# EAGLE design pt3MX (EAGLE 6.4)
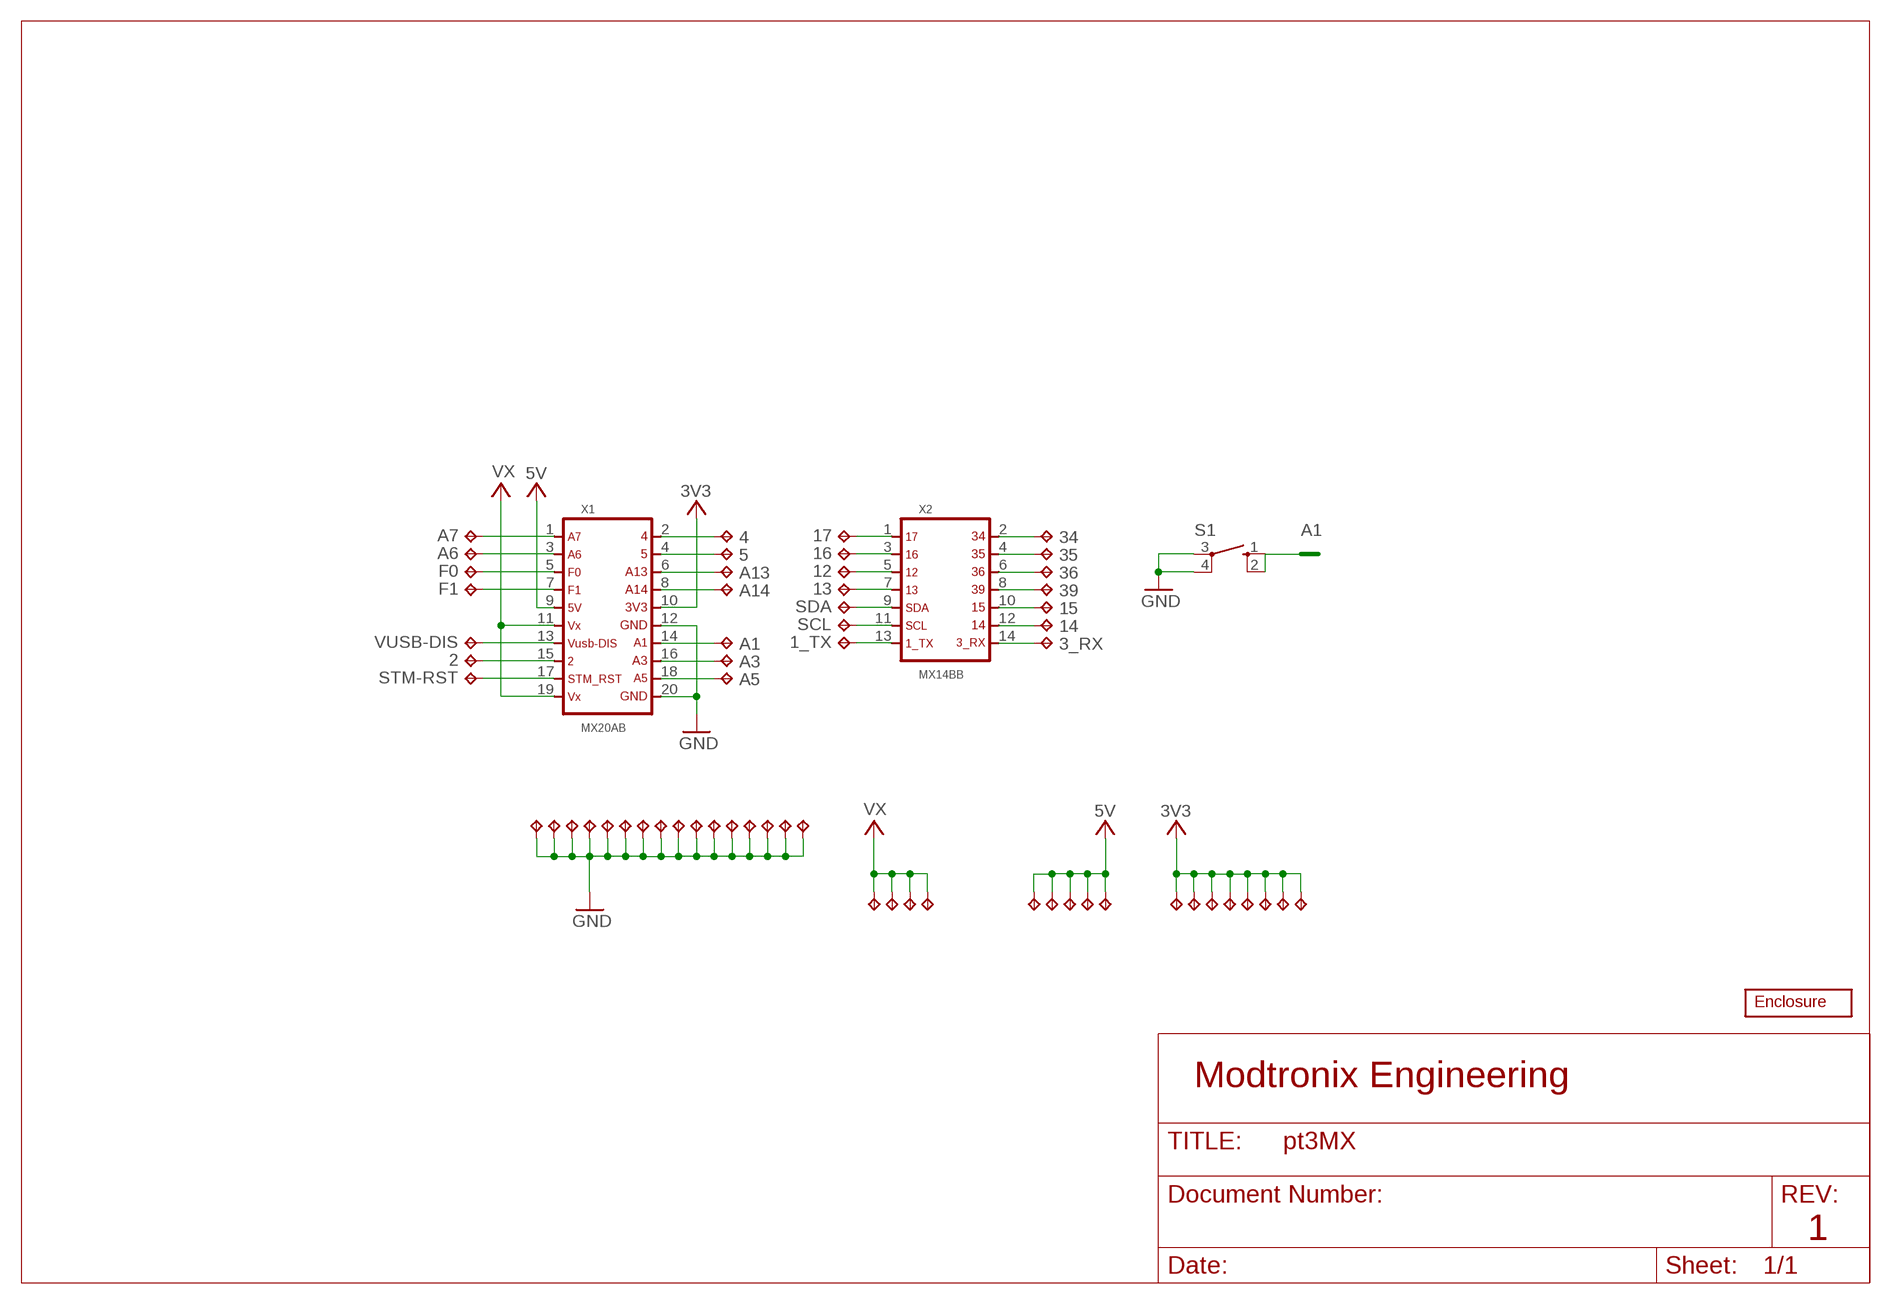
[diagram p0: schematic, sheet 1]

## Parts
1_TX  TPD10B  [TP-10B]
2  TPD10B  [TP-10B]
3_RX  TPD10B  [TP-10B]
4  TPD10C  [TP-10C]
5  TPD10B  [TP-10B]
12  TPD10B  [TP-10B]
13  TPD10B  [TP-10B]
14  TPD10B  [TP-10B]
15  TPD10C  [TP-10C]
16  TPD10B  [TP-10B]
17  TPD10B  [TP-10B]
34  TPD10C  [TP-10C]
35  TPD10C  [TP-10C]
36  TPD10B  [TP-10B]
39  TPD10B  [TP-10B]
A1  TPD10-D200  [TP-10-D200]
A3  TPD10-D200  [TP-10-D200]
A5  TPD10B  [TP-10B]
A6  TPD10B  [TP-10B]
A7  TPD10B  [TP-10B]
A13  TPD10B  [TP-10B]
A14  TPD10C  [TP-10C]
F0  TPD10C  [TP-10C]
F1  TPD10-D200  [TP-10-D200]
S1  SWITCH-MICRO  [SW-TACTILE-4P-TH]
SCL  TPD10B  [TP-10B]
SDA  TPD10C  [TP-10C]
STM-RST  TPD10B  [TP-10B]
U$1  ENC_2015SMX-AND-EC-B  [ENC_2015S_3H_MX-AND-EC_DIM-MSR_B]
U$2  TPD10-D205  [TP-10-D205]
U$5  TPD10D  [TP-10D]
U$6  TPD10-D205  [TP-10-D205]
U$7  TPD10-D205  [TP-10-D205]
U$8  TPD10-D205  [TP-10-D205]
U$10  TPD10D  [TP-10D]
U$11  TPD10C  [TP-10C]
U$12  TPD10-D205  [TP-10-D205]
U$13  TPD10C  [TP-10C]
U$14  TPD10  [TP-10]
U$17  TPD10-D205  [TP-10-D205]
U$22  TPD10-D205  [TP-10-D205]
U$23  TPD10C  [TP-10C]
U$24  TPD10C  [TP-10C]
U$25  TPD10C  [TP-10C]
U$26  TPD10C  [TP-10C]
U$27  TPD10C  [TP-10C]
U$28  TPD10C  [TP-10C]
U$29  TPD10C  [TP-10C]
U$30  TPD10C  [TP-10C]
U$31  TPD10C  [TP-10C]
U$32  TPD10C  [TP-10C]
U$33  TPD10B  [TP-10B]
U$34  TPD10C  [TP-10C]
U$35  TPD10C  [TP-10C]
U$36  TPD10C  [TP-10C]
U$53  TPD10-D205  [TP-10-D205]
U$58  TPD10C  [TP-10C]
U$60  TPD10-D205  [TP-10-D205]
U$85  TPD10-D205  [TP-10-D205]
U$86  TPD10-D205  [TP-10-D205]
U$87  TPD10-D205  [TP-10-D205]
U$90  TPD10-D205  [TP-10-D205]
VUSB-DIS  TPD10B  [TP-10B]
X1  MX20AB  [MA10-2-NONUM]
X2  MX14BB  [MA07-2-NONUM]

## Nets
1_TX: 1_TX.1(TP) X2.13
2: 2.1(TP) X1.15
3_RX: 3_RX.1(TP) X2.14
3V3: U$14.1(TP) U$25.1(TP) U$26.1(TP) U$31.1(TP) U$32.1(TP) U$53.1(TP) U$85.1(TP) U$86.1(TP) X1.10
4: 4.1(TP) X1.2
5: 5.1(TP) X1.4
5V [power]: U$12.1(TP) U$13.1(TP) U$23.1(TP) U$24.1(TP) U$87.1(TP) X1.9
12: 12.1(TP) X2.5
13: 13.1(TP) X2.7
14: 14.1(TP) X2.12
15: 15.1(TP) X2.10
16: 16.1(TP) X2.3
17: 17.1(TP) X2.1
34: 34.1(TP) X2.2
35: 35.1(TP) X2.4
36: 36.1(TP) X2.6
39: 39.1(TP) X2.8
A1: A1.1(TP) S1.1(S) S1.2(S1) X1.14
A3: A3.1(TP) X1.16
A5: A5.1(TP) X1.18
A6: A6.1(TP) X1.3
A7: A7.1(TP) X1.1
A13: A13.1(TP) X1.6
A14: A14.1(TP) X1.8
F0: F0.1(TP) X1.5
F1: F1.1(TP) X1.7
GND [power]: S1.3(P) S1.4(P1) U$5.1(TP) U$6.1(TP) U$7.1(TP) U$8.1(TP) U$10.1(TP) U$11.1(TP) U$17.1(TP) U$22.1(TP) U$27.1(TP) U$28.1(TP) U$29.1(TP) U$30.1(TP) U$34.1(TP) U$35.1(TP) U$36.1(TP) U$60.1(TP) X1.12 X1.20
SCL: SCL.1(TP) X2.11
SDA: SDA.1(TP) X2.9
STM-RST: STM-RST.1(TP) X1.17
VUSB-DIS: VUSB-DIS.1(TP) X1.13
VX [power]: U$2.1(TP) U$33.1(TP) U$58.1(TP) U$90.1(TP) X1.11 X1.19

## Notes on the sheet
- Modtronix Engineering
- 1

## Library data of the parts
1_TX 2 3_RX 4 5 12-17 34-36 39 A1 A3 A5-A7 A13 A14 F0 F1 SCL SDA STM-RST U$2 U$5-U$8 U$10-U$14 U$17 U$22-U$36 U$53 U$58 U$60 U$85-U$87 U$90 VUSB-DIS = mx-conn:TP
S1 = mx-misc:SWITCH-MICRO: OMRON SWITCH
U$1 = mx-misc:ENC_2015S
X1 = mx-conn:MX20A
X2 = mx-conn:MX14B

## Net classes
0 default: width 0.2 mm, drill 0.5 mm, clearance 0.2 mm
1 power: width 0.3 mm, drill 0.5 mm, clearance 0.2 mm

## Board
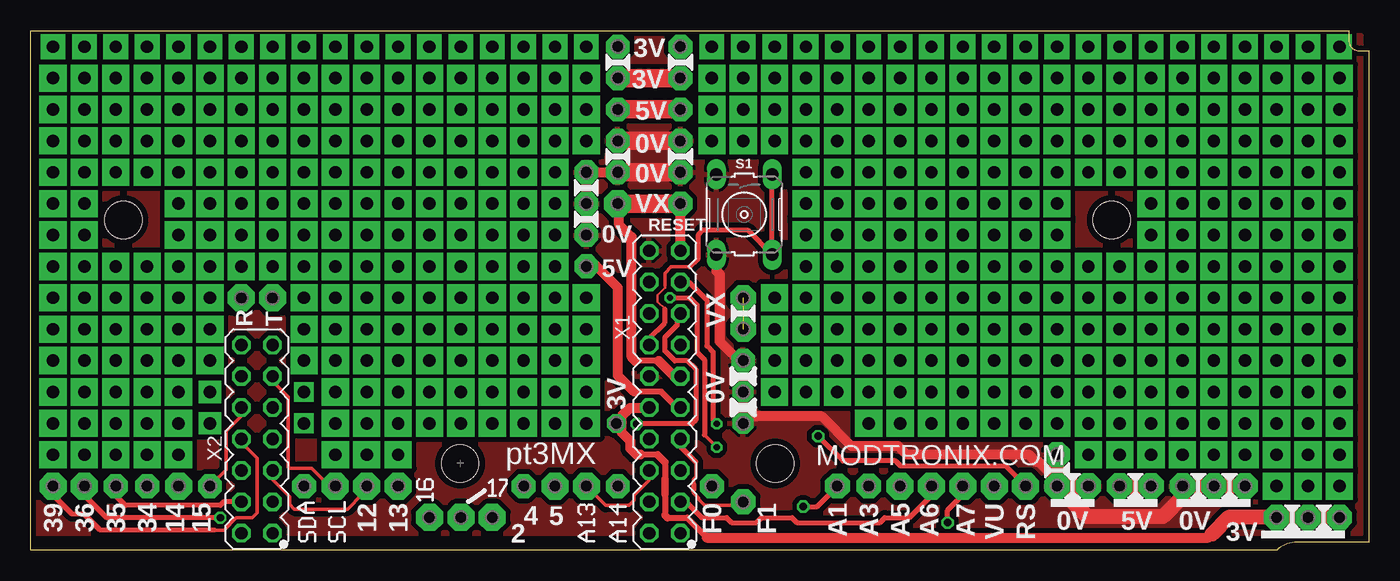
[diagram p1: board, top side]
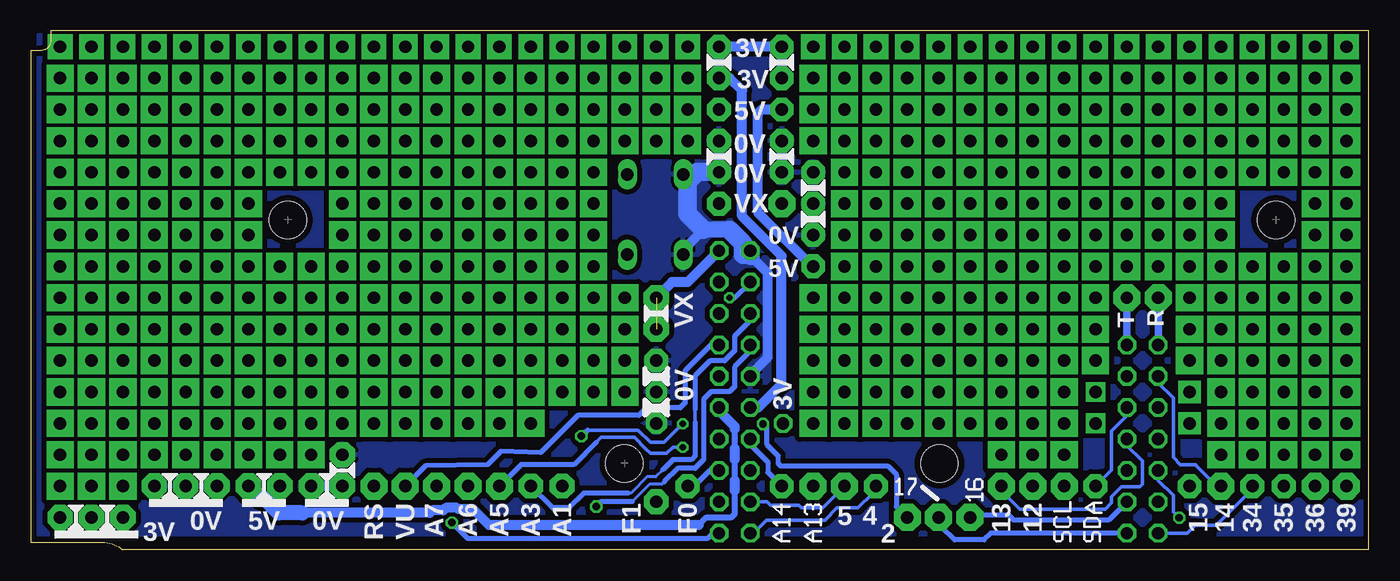
[diagram p2: board, bottom side, seen from below]

Size 108.3 x 42 mm. Coordinates in mm from the lower left corner, seen from the top.
Copper layers (1*16): Top 0.035mm / dielectric 1.5mm / Bottom 0.035mm
Design rules "12w_10clr_24drl *": minimum track width 0.2mm, minimum drill 0.5mm, track to track 10mil, track to pad 10mil, pad to pad 10mil, via to via 12mil, smd to smd 6mil, copper to edge 0.1mm, drill to drill 0.1mm, minimum pad ring 0.2mm, minimum via ring 0.2mm, stop-mask expansion 4mil, vias tented up to drill 28mil, thermal gap 10mil
Holes 3 mm at 34.75,7
tRestrict: area 33.2,5.5 to 36.2,8.5
bRestrict: area 33.2,5.5 to 36.3,8.5

### Footprints (pad centres in the part's own frame; a part is rotated, then mirrored left to right if it is on the bottom)
TP-10B = drill 1 pad 2.184 octagon: 1 0,0
TP-10C = drill 1 pad 1.93 octagon: 1 0,0
TP-10-D200 = drill 1 pad 2 octagon: 1 0,0
SW-TACTILE-4P-TH = drill 1.016 long: 1 -3.251,2.261; 2 3.251,2.261; 3 -3.251,-2.261; 4 3.251,-2.261
ENC_2015S_3H_MX-AND-EC_DIM-MSR_B = hole 3: 52.75,-19.7; 0,0; 80,0
TP-10-D205 = drill 1 pad 2.05 octagon: 1 0,0
TP-10D = drill 1 pad 1.7 octagon: 1 0,0
TP-10 = drill 1 pad 1.4 octagon: 1 0,0
MA10-2-NONUM = drill 1 octagon: 1 -11.43,-1.27; 2 -11.43,1.27; 3 -8.89,-1.27; 4 -8.89,1.27; 5 -6.35,-1.27; 6 -6.35,1.27; 7 -3.81,-1.27; 8 -3.81,1.27; 9 -1.27,-1.27; 10 -1.27,1.27; 11 1.27,-1.27; 12 1.27,1.27; 13 3.81,-1.27; 14 3.81,1.27; 15 6.35,-1.27; 16 6.35,1.27; 17 8.89,-1.27; 18 8.89,1.27; 19 11.43,-1.27; 20 11.43,1.27
MA07-2-NONUM = drill 1 octagon: 1 -7.62,-1.27; 2 -7.62,1.27; 3 -5.08,-1.27; 4 -5.08,1.27; 5 -2.54,-1.27; 6 -2.54,1.27; 7 0,-1.27; 8 0,1.27; 9 2.54,-1.27; 10 2.54,1.27; 11 5.08,-1.27; 12 5.08,1.27; 13 7.62,-1.27; 14 7.62,1.27

### Placement (x,y rotation side)
1_TX  19.57,20.4 270 top
2  37.35,2.62 270 top
3_RX  17.03,20.4 270 top
4  39.89,5.16 270 top
5  42.43,5.16 270 top
12  27.19,5.16 270 top
13  29.73,5.16 270 top
14  11.95,5.16 270 top
15  14.49,5.16 270 top
16  32.27,2.62 270 top
17  34.81,2.62 270 top
34  9.41,5.16 0 top
35  6.87,5.16 270 top
36  4.33,5.16 270 top
39  1.79,5.16 0 top
A1  65.29,5.16 270 top
A3  67.83,5.16 270 top
A5  70.37,5.16 270 top
A6  72.91,5.16 270 top
A7  75.45,5.16 270 top
A13  44.97,5.16 270 top
A14  47.51,5.16 270 top
F0  55.13,5.16 270 top
F1  57.67,3.89 270 top
S1  57.75,27.14 270 top
SCL  24.65,5.16 270 top
SDA  22.11,5.16 270 top
STM-RST  80.53,5.16 270 top
U$1  7.5,26.7 0 top
U$2  57.67,20.4 90 top
U$3  [ESP32MX_20-14P_0H_REF]  34.75,7 0 bottom
U$5  57.67,10.24 0 top
U$6  93.23,5.16 0 top
U$7  98.31,5.16 0 top
U$8  95.77,5.16 0 top
U$9  [A-56]  45.61,0.71 90 top
U$10  57.67,12.78 0 top
U$11  57.67,15.32 0 top
U$12  88.15,5.16 90 top
U$13  44.97,22.94 0 top
U$14  47.41,10.24 0 top
U$17  83.07,5.16 0 top
U$22  83.07,7.7 0 top
U$23  47.51,35.64 0 top
U$24  52.59,35.64 0 top
U$25  52.59,38.18 0 top
U$26  47.51,40.72 0 top
U$27  52.59,30.56 0 top
U$28  47.51,30.56 0 top
U$29  52.59,33.1 0 top
U$30  47.51,33.1 0 top
U$31  52.59,40.72 0 top
U$32  47.51,38.18 0 top
U$33  47.51,28.02 0 top
U$34  44.97,30.56 0 top
U$35  44.97,28.02 0 top
U$36  44.97,25.48 0 top
U$37  [3-56]  45.61,2.87 90 top
U$38  [S-56]  23,0.71 90 top
U$39  [4-56]  48.14,2.87 90 top
U$40  [A-56]  48.14,0.71 90 top
U$41  [1-56N]  45.61,1.98 90 top
U$42  [1-56N]  48.14,1.98 90 top
U$43  [S-56]  25.41,0.71 90 top
U$44  [D-56]  23,1.86 90 top
U$45  [A-56]  22.87,3 90 top
U$46  [C-56]  25.41,1.86 90 top
U$47  [L-56]  25.41,3.13 90 top
U$48  [1-56N]  32.52,4.02 90 top
U$49  [6-56]  32.52,4.91 90 top
U$50  [1-56N]  37.1,4.4 0 top
U$51  [S-56]  21.75,0.71 90 bottom
U$52  [7-56N]  37.98,4.4 0 top
U$53  100.85,2.62 0 top
U$54  [S-56]  24.16,0.71 90 bottom
U$55  [D-56]  21.75,1.86 90 bottom
U$56  [A-56]  21.62,3 90 bottom
U$57  [C-56]  24.16,1.86 90 bottom
U$58  52.59,28.02 0 top
U$59  [L-56]  24.16,3.13 90 bottom
U$60  85.61,5.16 0 top
U$61  [1-56N]  31.27,4.02 90 bottom
U$62  [6-56]  31.27,4.91 90 bottom
U$63  [1-56N]  38.25,4.5 0 bottom
U$64  [7-56N]  37.23,4.5 0 bottom
U$65  [A-56]  44.36,0.71 90 bottom
U$66  [4-56]  46.89,2.87 90 bottom
U$67  [A-56]  46.89,0.71 90 bottom
U$68  [1-56N]  44.36,1.98 90 bottom
U$69  [1-56N]  46.89,1.98 90 bottom
U$70  [3-56]  44.36,2.87 90 bottom
U$85  105.93,2.62 90 top
U$86  103.39,2.62 90 top
U$87  90.69,5.16 0 top
U$90  57.67,17.86 0 top
VUSB-DIS  77.99,5.16 270 top
X1  51.32,12.78 90 top
X2  18.3,8.97 90 top

### Tracks (layer width: path | path; a pad name or v marks a point on that pad's centre or on a via)
1_TX
  Bottom 0.6: 1_TX.1 X2.13
2  (via drill 0.6)
  Top 0.4: v49.03,10.2 53.53,10.2 53.83,10.5 53.83,14.6 53.13,15.3 52.13,15.3 51.33,16.1 51.33,17.2 52.33,18.2 52.33,18.87 X1.15
  Bottom 0.4: v49.03,10.2 48.73,9.9 48.73,8.55 47.8,7.63 47.8,7 47.6,6.8 38.93,6.8 38.23,6.1 38.23,3.5 2.1
3_RX
  Bottom 0.6: 3_RX.1 X2.14
3V3
  Top 0.3: U$14.1 47.77,10.24 47.83,10.3
  Top 0.48: 51.53,2.6 53.13,2.6
  Top 0.5: 51.33,7.1 51.33,5.7 | 51.33,4.5 51.33,2.8 | 53.13,2.6 54.73,1 | 50.73,7.7 49.33,7.7
  Top 0.6: 50.73,7.7 51.33,7.1 | 51.33,5.7 51.33,4.5 | 51.33,2.8 51.53,2.6
  Top 0.8: 54.73,1 95.33,1 95.63,1.3 | 49.33,7.7 49.03,7.7 48.53,8.2 48.53,8.8 47.83,9.5 47.83,10.3 47.83,10.8 48.53,11.5 X1.10
  Top 1.2: U$85.1 U$86.1 U$53.1 96.95,2.62 95.63,1.3
  Top 1.5: U$25.1 U$32.1
  Bottom 0.8: X1.10 49.42,11.51 47.53,13.4 47.53,23.8 50.73,27 50.73,37.18 51.73,38.18 U$25.1 | U$32.1 47.49,38.2 47.49,40.7 U$26.1 U$31.1 52.59,38.26 52.53,38.2
4
  Bottom 0.3: X1.2 49.78,1.35 48.73,2.4 44.03,2.4 43.03,3.4 41.33,3.4 40.13,4.6 40.13,4.92 4.1
5
  Bottom 0.3: X1.4 48.72,3.89 48.43,3.6 46.13,3.6 45.93,3.4 44.19,3.4 5.1
5V
  Top 0.48: 51.03,12.8 48.83,12.8
  Top 0.5: X1.9 52.32,11.51 51.03,12.8
  Top 0.8: 48.83,12.8 47.53,14.1 47.53,21.2 45.63,23.1 45.38,22.53 U$13.1 | 47.03,35.6 47.47,35.6 U$23.1
  Top 1.2: U$12.1 U$87.1
  Top 1.5: U$23.1 U$24.1
  Bottom 0.48: 51.63,2.6 53.63,2.6
  Bottom 0.5: 51.33,9.8 51.33,8.2 | 51.33,7.3 51.33,5.6 | 51.33,4.8 51.33,2.9 51.63,2.6 | 53.63,2.6 54.23,2
  Bottom 0.8: X1.9 52.59,11.26 51.33,10 51.33,9.8 | 51.33,8.2 51.33,7.3 | 51.33,5.6 51.33,4.8 | 54.23,2 71.21,2 72.51,3.3 73.71,3.3 73.81,3.4 74.71,3.4 74.91,3.2 75.81,3.2 76.01,3 86.33,3 | U$13.1 45.07,22.94 49.43,27.3 49.43,35.34 49.13,35.64 U$23.1
  Bottom 1.2: 86.33,3 88.23,3 89.43,4.2 89.73,4.2 U$87.1
12
  Top 0.3: X2.5 19.57,5.66 20.93,4.3 20.93,3.7 21.33,3.3 25.63,3.3 26.83,4.5 26.83,4.8 12.1
13
  Bottom 0.3: X2.7 19.57,8.44 18.33,7.2 18.33,5.3 18.53,5.1 20.03,5.1 20.83,4.3 20.83,3.8 21.33,3.3 28.23,3.3 29.73,4.8 13.1
14
  Bottom 0.3: X2.12 17.03,13.5 15.83,12.3 15.83,7.5 15.23,6.9 13.99,6.9 13.99,6.86 12.53,5.4 14.1
15
  Top 0.3: X2.10 17.03,10.8 15.83,9.6 15.83,6.5 15.1
16
  Bottom 0.4: X2.3 19.54,3.89 20.63,2.8 21.03,2.4 28.73,2.4 29.13,2.8 32.09,2.8 16.1
17
  Bottom 0.4: X2.1 30.58,1.35 31.13,0.8 33.53,0.8 34.53,1.8 34.53,2.34 17.1
34
  Bottom 0.3: X2.2 14.68,1.35 14.03,2 12.33,2 9.63,4.7 8.95,4.7 34.1
  Bottom 0.4: 9.25,5 34.1
35
  Top 0.4: X2.4 15.62,3.89 15.33,3.6 7.65,3.6 6.95,4.3 6.95,5.08 35.1
36  (via drill 0.6)
  Top 0.3: 4.35,5.14 36.1
  Top 0.4: v15.33,2.6 6.13,2.6 4.53,4.2 4.53,4.96 36.1
  Bottom 0.3: X2.6 17.03,5.6 15.83,4.4 15.83,3.1 v15.33,2.6
39
  Top 0.3: X2.8 17.03,8.7 18.33,7.4 18.33,3 17.93,2.6 16.63,2.6 15.63,1.6 14.85,1.6
  Top 0.4: 14.85,1.6 5.63,1.6 4.33,2.9 3.33,2.9 1.73,4.5 1.73,5.1 39.1
A1  (via drill 0.6)
  Top 0.22: 51.33,19.5 50.73,20.1 50.73,20.6 51.33,21.2 51.33,21.4
  Top 0.3: 51.33,21.4 51.33,22.4 51.83,22.9 53.33,22.9
  Top 0.4: X1.14 50.05,17.12 51.33,18.4 51.33,19.5 | 53.33,22.9 54.03,23.6 54.03,25.5 54.43,25.9 58,25.9 S1.2 S1.1 | v62.53,3.5 63.63,3.5 A1.1
  Bottom 0.25: 57.03,5.5 57.23,5.3 58.23,5.3 59.63,3.9
  Bottom 0.4: X1.14 50.03,16.57 50.03,16.1 51.33,14.8 51.33,13.2 51.73,12.8 53.23,12.8 53.83,12.2 53.83,7.3 54.53,6.6 55.93,6.6 57.03,5.5 | 59.63,3.9 62.13,3.9 v62.53,3.5
A3
  Bottom 0.25: 57.13,6.5 57.73,5.9 58.43,5.9 59.73,4.6 59.93,4.6
  Bottom 0.3: 54.53,11.4 54.53,10.3
  Bottom 0.4: X1.16 50.05,18.58 51.33,17.3 51.33,16.1 52.13,15.3 53.33,15.3 54.53,14.1 54.53,11.4 | 54.53,10.3 54.53,7.6 54.83,7.3 56.33,7.3 57.13,6.5 | 59.93,4.6 63.53,4.6 64.73,3.4 66.07,3.4 A3.1
A5  (via drill 0.5)
  Top 0.3: 54.53,9.3 v55.53,8.3
  Top 0.4: v51.73,20.4 53.33,20.4 53.93,19.8 53.93,16 54.53,15.4 54.53,9.3
  Bottom 0.3: v55.53,8.3 56.33,8.3 56.83,7.8 58.13,7.8 58.53,8.2 59.43,9.1 62.13,9.1 62.53,8.7
  Bottom 0.4: v51.73,20.4 51.32,20.4 X1.18 | 62.53,8.7 64.33,6.9 68.63,6.9 A5.1
A6
  Top 0.4: X1.3 53.04,3.89 54.33,2.6 56.33,2.6 56.73,2.2 58.73,2.2 59.13,2.6 61.63,2.6 62.03,2.2 68.73,2.2 69.13,2.6 | 69.13,2.6 69.11,2.6 | 69.13,2.6 71.11,2.6 72.81,4.3 72.81,5.06 A6.1
A7  (via drill 0.6)
  Top 0.4: v74.21,2.2 74.21,3.2 75.41,4.4 75.41,5.12 A7.1
  Bottom 0.4: X1.1 53.08,1.35 53.53,0.9 72.91,0.9 v74.21,2.2
A13
  Top 0.3: X1.6 50.05,5.62 48.83,4.4 48.83,4 48.43,3.6 46.53,3.6 A13.1
A14
  Bottom 0.4: X1.8 50.05,8.52 48.63,7.1 48.63,6.28 A14.1
F0
  Bottom 0.4: X1.5 53.36,6.43 53.36,6.42 54.63,5.15 F0.1
F1
  Top 0.3: 53.83,7.1 53.83,5.9 53.63,5.7 53.63,5.4 | 53.63,4.8 53.63,4.6 54.03,4.2 54.03,4.1 54.53,3.6 57.38,3.6 F1.1
  Top 0.4: X1.7 52.59,8.34 53.83,7.1 | 53.63,5.4 53.63,4.8
GND
  Top 0.8: U$17.1 83.07,5.66 81.63,7.1 81.38,7.1 80.78,7.7 70.93,7.7 70.23,8.4 66.43,8.4 64.03,10.8 58.67,10.8 57.67,11.8 | U$5.1 57.67,11.8 | U$36.1 U$35.1 U$34.1 48.03,30.56 | S1.4 55.49,22.58 55.77,22.3 55.77,16.86 57.13,15.5 57.49,15.5 U$11.1 U$10.1 57.67,11.8
  Top 1.2: 84.33,5.16 84.33,3.9 85.53,2.7 91.63,2.7 93.23,4.3 U$6.1 U$8.1 U$7.1 | U$60.1 84.33,5.16 | 84.33,5.16 83.17,5.16 83.13,5.2 84.29,5.2 84.33,5.16 | U$22.1 83.03,7.7 83.03,5.7 83.07,5.66
  Top 1.5: U$27.1 48.03,30.56 U$28.1 | U$29.1 47.53,33.1
  Bottom 0.8: U$28.1 U$30.1 | U$27.1 U$29.1 | X1.12 50.05,14.18 48.63,15.6 48.63,22.4 50.03,23.8 50.03,24.19 X1.20 | U$17.1 U$60.1 | S1.4 55.49,24.24 53.83,25.9 | S1.3 55.49,30.16 55.13,29.8
  Bottom 1.3: 51.73,25.9 53.83,25.9
  Bottom 1.5: X1.20 50.03,23.8 50.63,23.9 50.63,24.8 51.73,25.9 | 53.83,25.9 55.13,27.2 55.13,29.8 54.33,30.6 52.63,30.6 U$27.1
  pour Top (isolate 0.406): 0.54,41.64 107.67,41.64 107.67,1.28 0.54,1.28
  pour Bottom (isolate 0.406): 0.54,41.64 107.67,41.64 107.67,1.28 0.54,1.28
N$1  (via drill 1 pad 2.2)
  other vias: 98.31,15.32
N$2  (via drill 1 pad 2.2)
  other vias: 62.75,12.78
N$3  (via drill 1 pad 2.2)
  other vias: 67.83,10.24
N$4  (via drill 1 pad 2.2)
  other vias: 70.37,10.24
N$5  (via drill 1 pad 2.2)
  other vias: 72.91,10.24
N$6  (via drill 1 pad 2.2)
  other vias: 75.45,10.24
N$7  (via drill 1 pad 2.2)
  other vias: 77.99,10.24
N$8  (via drill 1 pad 2.2)
  other vias: 80.53,10.24
N$9  (via drill 1 pad 2.2)
  other vias: 83.07,10.24
N$10  (via drill 1 pad 2.2)
  other vias: 1.79,20.4
N$11  (via drill 1 pad 2.2)
  other vias: 85.61,10.24
N$12  (via drill 1 pad 2.2)
  other vias: 88.15,10.24
N$13  (via drill 1 pad 2.2)
  other vias: 90.69,10.24
N$14  (via drill 1 pad 2.2)
  other vias: 93.23,10.24
N$15  (via drill 1 pad 2.2)
  other vias: 95.77,10.24
N$16  (via drill 1 pad 2.2)
  other vias: 98.31,10.24
N$17  (via drill 1 pad 2.2)
  other vias: 100.85,10.24
N$18  (via drill 1 pad 2.2)
  other vias: 103.39,10.24
N$19  (via drill 1 pad 2.2)
  other vias: 105.93,10.24
N$20  (via drill 1 pad 2.2)
  other vias: 85.61,7.7
N$21  (via drill 1 pad 2.2)
  other vias: 88.15,7.7
N$22  (via drill 1 pad 2.2)
  other vias: 90.69,7.7
N$23  (via drill 1 pad 2.2)
  other vias: 93.23,7.7
N$24  (via drill 1 pad 2.2)
  other vias: 95.77,7.7
N$25  (via drill 1 pad 2.2)
  other vias: 98.31,7.7
N$26  (via drill 1 pad 2.2)
  other vias: 100.85,7.7
N$27  (via drill 1 pad 2.2)
  other vias: 103.39,7.7
N$28  (via drill 1 pad 2.2)
  other vias: 105.93,7.7
N$29  (via drill 1 pad 2.2)
  other vias: 105.93,12.78
N$30  (via drill 1 pad 2.2)
  other vias: 103.39,12.78
N$31  (via drill 1 pad 2.2)
  other vias: 100.85,12.78
N$32  (via drill 1 pad 2.2)
  other vias: 98.31,12.78
N$33  (via drill 1 pad 2.2)
  other vias: 95.77,12.78
N$34  (via drill 1 pad 2.2)
  other vias: 93.23,12.78
N$35  (via drill 1 pad 2.2)
  other vias: 90.69,12.78
N$36  (via drill 1 pad 2.2)
  other vias: 85.61,12.78
N$37  (via drill 1 pad 2.2)
  other vias: 88.15,12.78
N$38  (via drill 1 pad 2.2)
  other vias: 83.07,12.78
N$39  (via drill 1 pad 2.2)
  other vias: 80.53,12.78
N$40  (via drill 1 pad 2.2)
  other vias: 77.99,12.78
N$41  (via drill 1 pad 2.2)
  other vias: 75.45,12.78
N$42  (via drill 1 pad 2.2)
  other vias: 72.91,12.78
N$43  (via drill 1 pad 2.2)
  other vias: 70.37,12.78
N$44  (via drill 1 pad 2.2)
  other vias: 67.83,12.78
N$45  (via drill 1 pad 2.2)
  other vias: 65.29,12.78
N$46  (via drill 1 pad 2.2)
  other vias: 60.21,12.78
N$48  (via drill 1 pad 2)
  other vias: 44.97,40.72
N$49  (via drill 1 pad 2)
  other vias: 42.43,40.72
N$50  (via drill 1 pad 2)
  other vias: 39.89,40.72
N$51  (via drill 1 pad 2)
  other vias: 37.35,40.72
N$52  (via drill 1 pad 2.2)
  other vias: 60.21,20.4
N$53  (via drill 1 pad 2.2)
  other vias: 60.21,17.86
N$54  (via drill 1 pad 2.2)
  other vias: 60.21,15.32
N$55  (via drill 1 pad 2.2)
  other vias: 62.75,15.32
N$56  (via drill 1 pad 2.2)
  other vias: 62.75,17.86
N$57  (via drill 1 pad 2.2)
  other vias: 62.75,20.4
N$58  (via drill 1 pad 2.2)
  other vias: 65.29,20.4
N$59  (via drill 1 pad 2.2)
  other vias: 65.29,15.32
N$60  (via drill 1 pad 2.2)
  other vias: 65.29,17.86
N$61  (via drill 1 pad 2.2)
  other vias: 65.29,22.94
N$62  (via drill 1 pad 2.2)
  other vias: 65.29,25.48
N$63  (via drill 1 pad 2.2)
  other vias: 65.29,28.02
N$64  (via drill 1 pad 2.2)
  other vias: 62.75,22.94
N$65  (via drill 1 pad 2.2)
  other vias: 62.75,25.48
N$66  (via drill 1 pad 2.2)
  other vias: 62.75,28.02
N$67  (via drill 1 pad 2.2)
  other vias: 62.75,30.56
N$68  (via drill 1 pad 2.2)
  other vias: 62.75,33.1
N$69  (via drill 1 pad 2.2)
  other vias: 62.75,35.64
N$70  (via drill 1 pad 2.2)
  other vias: 62.75,38.18
N$71  (via drill 1 pad 2)
  other vias: 62.75,40.72
N$72  (via drill 1 pad 2)
  other vias: 65.29,40.72
N$73  (via drill 1 pad 2)
  other vias: 67.83,40.72
N$74  (via drill 1 pad 2)
  other vias: 70.37,40.72
N$75  (via drill 1 pad 2)
  other vias: 72.91,40.72
N$76  (via drill 1 pad 2)
  other vias: 75.45,40.72
N$77  (via drill 1 pad 2)
  other vias: 77.99,40.72
N$78  (via drill 1 pad 2)
  other vias: 83.07,40.72
N$79  (via drill 1 pad 2)
  other vias: 80.53,40.72
N$80  (via drill 1 pad 2)
  other vias: 85.61,40.72
N$81  (via drill 1 pad 2)
  other vias: 88.15,40.72
N$82  (via drill 1 pad 2)
  other vias: 90.69,40.72
N$83  (via drill 1 pad 2)
  other vias: 95.77,40.72
N$84  (via drill 1 pad 2)
  other vias: 93.23,40.72
N$85  (via drill 1 pad 2)
  other vias: 98.31,40.72
N$86  (via drill 1 pad 2)
  other vias: 100.85,40.72
N$87  (via drill 1 pad 2)
  other vias: 105.93,40.72
N$88  (via drill 1 pad 2)
  other vias: 103.39,40.72
N$89  (via drill 1 pad 2.2)
  other vias: 105.93,38.18
N$90  (via drill 1 pad 2.2)
  other vias: 105.93,35.64
N$91  (via drill 1 pad 2.2)
  other vias: 105.93,33.1
N$92  (via drill 1 pad 2.2)
  other vias: 105.93,30.56
N$93  (via drill 1 pad 2.2)
  other vias: 105.93,28.02
N$94  (via drill 1 pad 2.2)
  other vias: 105.93,25.48
N$95  (via drill 1 pad 2.2)
  other vias: 105.93,22.94
N$96  (via drill 1 pad 2.2)
  other vias: 105.93,20.4
N$97  (via drill 1 pad 2.2)
  other vias: 105.93,17.86
N$98  (via drill 1 pad 2.2)
  other vias: 105.93,15.32
N$99  (via drill 1 pad 2.2)
  other vias: 103.39,15.32
N$100  (via drill 1 pad 2.2)
  other vias: 103.39,17.86
N$101  (via drill 1 pad 2.2)
  other vias: 103.39,20.4
N$102  (via drill 1 pad 2.2)
  other vias: 103.39,22.94
N$103  (via drill 1 pad 2.2)
  other vias: 103.39,25.48
N$104  (via drill 1 pad 2.2)
  other vias: 103.39,28.02
N$105  (via drill 1 pad 2.2)
  other vias: 103.39,30.56
N$106  (via drill 1 pad 2.2)
  other vias: 103.39,33.1
N$107  (via drill 1 pad 2.2)
  other vias: 103.39,35.64
N$108  (via drill 1 pad 2.2)
  other vias: 103.39,38.18
N$109  (via drill 1 pad 2.2)
  other vias: 100.85,38.18
N$110  (via drill 1 pad 2.2)
  other vias: 100.85,35.64
N$111  (via drill 1 pad 2.2)
  other vias: 100.85,33.1
N$112  (via drill 1 pad 2.2)
  other vias: 100.85,30.56
N$113  (via drill 1 pad 2.2)
  other vias: 100.85,28.02
N$114  (via drill 1 pad 2.2)
  other vias: 100.85,25.48
N$115  (via drill 1 pad 2.2)
  other vias: 100.85,22.94
N$116  (via drill 1 pad 2.2)
  other vias: 100.85,20.4
N$117  (via drill 1 pad 2.2)
  other vias: 100.85,17.86
N$118  (via drill 1 pad 2.2)
  other vias: 100.85,15.32
N$119  (via drill 1 pad 2.2)
  other vias: 98.31,17.86
N$120  (via drill 1 pad 2.2)
  other vias: 98.31,20.4
N$121  (via drill 1 pad 2.2)
  other vias: 98.31,22.94
N$122  (via drill 1 pad 2.2)
  other vias: 98.31,25.48
N$123  (via drill 1 pad 2.2)
  other vias: 98.31,28.02
N$124  (via drill 1 pad 2.2)
  other vias: 98.31,30.56
N$125  (via drill 1 pad 2.2)
  other vias: 98.31,33.1
N$126  (via drill 1 pad 2.2)
  other vias: 98.31,35.64
N$127  (via drill 1 pad 2.2)
  other vias: 98.31,38.18
N$128  (via drill 1 pad 2.2)
  other vias: 95.77,38.18
N$129  (via drill 1 pad 2.2)
  other vias: 95.77,35.64
N$130  (via drill 1 pad 2.2)
  other vias: 95.77,33.1
N$131  (via drill 1 pad 2.2)
  other vias: 95.77,30.56
N$132  (via drill 1 pad 2.2)
  other vias: 95.77,28.02
N$133  (via drill 1 pad 2.2)
  other vias: 95.77,25.48
N$134  (via drill 1 pad 2.2)
  other vias: 95.77,22.94
N$135  (via drill 1 pad 2.2)
  other vias: 95.77,20.4
N$136  (via drill 1 pad 2.2)
  other vias: 95.77,17.86
N$137  (via drill 1 pad 2.2)
  other vias: 95.77,15.32
N$138  (via drill 1 pad 2.2)
  other vias: 93.23,15.32
N$139  (via drill 1 pad 2.2)
  other vias: 93.23,17.86
N$140  (via drill 1 pad 2.2)
  other vias: 93.23,20.4
N$141  (via drill 1 pad 2.2)
  other vias: 93.23,22.94
N$142  (via drill 1 pad 2.2)
  other vias: 93.23,25.48
N$143  (via drill 1 pad 2.2)
  other vias: 93.23,28.02
N$144  (via drill 1 pad 2.2)
  other vias: 93.23,30.56
N$145  (via drill 1 pad 2.2)
  other vias: 93.23,33.1
N$146  (via drill 1 pad 2.2)
  other vias: 93.23,35.64
N$147  (via drill 1 pad 2.2)
  other vias: 93.23,38.18
N$148  (via drill 1 pad 2.2)
  other vias: 90.69,38.18
N$149  (via drill 1 pad 2.2)
  other vias: 90.69,35.64
N$150  (via drill 1 pad 2.2)
  other vias: 90.69,33.1
N$151  (via drill 1 pad 2.2)
  other vias: 90.69,30.56
N$152  (via drill 1 pad 2.2)
  other vias: 90.69,28.02
N$153  (via drill 1 pad 2.2)
  other vias: 90.69,25.48
N$154  (via drill 1 pad 2.2)
  other vias: 90.69,22.94
N$155  (via drill 1 pad 2.2)
  other vias: 90.69,20.4
N$156  (via drill 1 pad 2.2)
  other vias: 90.69,17.86
N$157  (via drill 1 pad 2.2)
  other vias: 90.69,15.32
N$158  (via drill 1 pad 2.2)
  other vias: 88.15,15.32
N$159  (via drill 1 pad 2.2)
  other vias: 88.15,17.86
N$160  (via drill 1 pad 2.2)
  other vias: 88.15,20.4
N$161  (via drill 1 pad 2.2)
  other vias: 88.15,22.94
N$162  (via drill 1 pad 2.2)
  other vias: 85.61,22.94
N$163  (via drill 1 pad 2.2)
  other vias: 83.07,22.94
N$164  (via drill 1 pad 2.2)
  other vias: 83.07,25.48
N$165  (via drill 1 pad 2.2)
  other vias: 83.07,28.02
N$166  (via drill 1 pad 2.2)
  other vias: 83.07,30.56
N$167  (via drill 1 pad 2.2)
  other vias: 85.61,30.56
N$168  (via drill 1 pad 2.2)
  other vias: 88.15,30.56
N$169  (via drill 1 pad 2.2)
  other vias: 88.15,33.1
N$170  (via drill 1 pad 2.2)
  other vias: 85.61,33.1
N$171  (via drill 1 pad 2.2)
  other vias: 83.07,33.1
N$172  (via drill 1 pad 2.2)
  other vias: 83.07,35.64
N$173  (via drill 1 pad 2.2)
  other vias: 88.15,35.64
N$174  (via drill 1 pad 2.2)
  other vias: 85.61,35.64
N$175  (via drill 1 pad 2.2)
  other vias: 88.15,38.18
N$176  (via drill 1 pad 2.2)
  other vias: 85.61,38.18
N$177  (via drill 1 pad 2.2)
  other vias: 83.07,38.18
N$178  (via drill 1 pad 2.2)
  other vias: 83.07,20.4
N$179  (via drill 1 pad 2.2)
  other vias: 85.61,20.4
N$180  (via drill 1 pad 2.2)
  other vias: 85.61,17.86
N$181  (via drill 1 pad 2.2)
  other vias: 83.07,17.86
N$182  (via drill 1 pad 2.2)
  other vias: 83.07,15.32
N$183  (via drill 1 pad 2.2)
  other vias: 85.61,15.32
N$184  (via drill 1 pad 2.2)
  other vias: 80.53,15.32
N$185  (via drill 1 pad 2.2)
  other vias: 80.53,17.86
N$186  (via drill 1 pad 2.2)
  other vias: 80.53,20.4
N$187  (via drill 1 pad 2.2)
  other vias: 80.53,22.94
N$188  (via drill 1 pad 2.2)
  other vias: 80.53,25.48
N$189  (via drill 1 pad 2.2)
  other vias: 80.53,28.02
N$190  (via drill 1 pad 2.2)
  other vias: 80.53,30.56
N$191  (via drill 1 pad 2.2)
  other vias: 80.53,33.1
N$192  (via drill 1 pad 2.2)
  other vias: 80.53,35.64
N$193  (via drill 1 pad 2.2)
  other vias: 80.53,38.18
N$194  (via drill 1 pad 2.2)
  other vias: 77.99,38.18
N$195  (via drill 1 pad 2.2)
  other vias: 77.99,35.64
N$196  (via drill 1 pad 2.2)
  other vias: 77.99,33.1
N$197  (via drill 1 pad 2.2)
  other vias: 77.99,30.56
N$198  (via drill 1 pad 2.2)
  other vias: 77.99,28.02
N$199  (via drill 1 pad 2.2)
  other vias: 77.99,25.48
N$200  (via drill 1 pad 2.2)
  other vias: 77.99,22.94
N$201  (via drill 1 pad 2.2)
  other vias: 77.99,20.4
N$202  (via drill 1 pad 2.2)
  other vias: 77.99,17.86
N$203  (via drill 1 pad 2.2)
  other vias: 77.99,15.32
N$204  (via drill 1 pad 2.2)
  other vias: 75.45,15.32
N$205  (via drill 1 pad 2.2)
  other vias: 75.45,17.86
N$206  (via drill 1 pad 2.2)
  other vias: 75.45,20.4
N$207  (via drill 1 pad 2.2)
  other vias: 75.45,22.94
N$208  (via drill 1 pad 2.2)
  other vias: 75.45,25.48
N$209  (via drill 1 pad 2.2)
  other vias: 75.45,28.02
N$210  (via drill 1 pad 2.2)
  other vias: 75.45,30.56
N$211  (via drill 1 pad 2.2)
  other vias: 75.45,33.1
N$212  (via drill 1 pad 2.2)
  other vias: 75.45,35.64
N$213  (via drill 1 pad 2.2)
  other vias: 75.45,38.18
N$214  (via drill 1 pad 2.2)
  other vias: 72.91,38.18
N$215  (via drill 1 pad 2.2)
  other vias: 72.91,35.64
N$216  (via drill 1 pad 2.2)
  other vias: 72.91,33.1
N$217  (via drill 1 pad 2.2)
  other vias: 72.91,30.56
N$218  (via drill 1 pad 2.2)
  other vias: 72.91,28.02
N$219  (via drill 1 pad 2.2)
  other vias: 72.91,25.48
N$220  (via drill 1 pad 2.2)
  other vias: 72.91,22.94
N$221  (via drill 1 pad 2.2)
  other vias: 72.91,20.4
N$222  (via drill 1 pad 2.2)
  other vias: 72.91,17.86
N$223  (via drill 1 pad 2.2)
  other vias: 72.91,15.32
N$224  (via drill 1 pad 2.2)
  other vias: 70.37,15.32
N$225  (via drill 1 pad 2.2)
  other vias: 70.37,17.86
N$226  (via drill 1 pad 2.2)
  other vias: 70.37,20.4
N$227  (via drill 1 pad 2.2)
  other vias: 70.37,22.94
N$228  (via drill 1 pad 2.2)
  other vias: 70.37,25.48
N$229  (via drill 1 pad 2.2)
  other vias: 70.37,28.02
N$230  (via drill 1 pad 2.2)
  other vias: 70.37,30.56
N$231  (via drill 1 pad 2.2)
  other vias: 70.37,33.1
N$232  (via drill 1 pad 2.2)
  other vias: 70.37,35.64
N$233  (via drill 1 pad 2.2)
  other vias: 70.37,38.18
N$234  (via drill 1 pad 2.2)
  other vias: 67.83,38.18
N$235  (via drill 1 pad 2.2)
  other vias: 65.29,38.18
N$236  (via drill 1 pad 2.2)
  other vias: 65.29,35.64
N$237  (via drill 1 pad 2.2)
  other vias: 67.83,35.64
N$238  (via drill 1 pad 2.2)
  other vias: 67.83,33.1
N$239  (via drill 1 pad 2.2)
  other vias: 65.29,33.1
N$240  (via drill 1 pad 2.2)
  other vias: 65.29,30.56
N$241  (via drill 1 pad 2.2)
  other vias: 67.83,30.56
N$242  (via drill 1 pad 2.2)
  other vias: 67.83,28.02
N$243  (via drill 1 pad 2.2)
  other vias: 67.83,25.48
N$244  (via drill 1 pad 2.2)
  other vias: 67.83,22.94
N$245  (via drill 1 pad 2.2)
  other vias: 67.83,20.4
N$246  (via drill 1 pad 2.2)
  other vias: 67.83,17.86
N$247  (via drill 1 pad 2.2)
  other vias: 67.83,15.32
N$249  (via drill 1 pad 2.2)
  other vias: 100.85,5.16
N$250  (via drill 1 pad 2.2)
  other vias: 103.39,5.16
N$251  (via drill 1 pad 2.2)
  other vias: 105.93,5.16
N$255  (via drill 1 pad 2.2)
  other vias: 44.97,38.18
N$257  (via drill 1 pad 2)
  other vias: 60.21,40.72
N$258  (via drill 1 pad 2)
  other vias: 57.67,40.72
N$259  (via drill 1 pad 2)
  other vias: 55.13,40.72
N$260  (via drill 1 pad 2.2)
  other vias: 55.13,38.18
N$261  (via drill 1 pad 2.2)
  other vias: 57.67,38.18
N$262  (via drill 1 pad 2.2)
  other vias: 60.21,38.18
N$263  (via drill 1 pad 2.2)
  other vias: 60.21,35.64
N$264  (via drill 1 pad 2.2)
  other vias: 57.67,35.64
N$265  (via drill 1 pad 2.2)
  other vias: 55.13,35.64
N$266  (via drill 1 pad 2.2)
  other vias: 55.13,33.1
N$267  (via drill 1 pad 2.2)
  other vias: 57.67,33.1
N$268  (via drill 1 pad 2.2)
  other vias: 60.21,33.1
N$269  (via drill 1 pad 2)
  other vias: 34.81,40.72
N$270  (via drill 1 pad 2)
  other vias: 32.27,40.72
N$271  (via drill 1 pad 2)
  other vias: 29.73,40.72
N$272  (via drill 1 pad 2)
  other vias: 27.19,40.72
N$273  (via drill 1 pad 2)
  other vias: 24.65,40.72
N$274  (via drill 1 pad 2)
  other vias: 22.11,40.72
N$275  (via drill 1 pad 2)
  other vias: 19.57,40.72
N$276  (via drill 1 pad 2)
  other vias: 17.03,40.72
N$277  (via drill 1 pad 2)
  other vias: 14.49,40.72
N$278  (via drill 1 pad 2)
  other vias: 11.95,40.72
N$279  (via drill 1 pad 2)
  other vias: 9.41,40.72
N$280  (via drill 1 pad 2)
  other vias: 6.87,40.72
N$281  (via drill 1 pad 2)
  other vias: 4.33,40.72
N$282  (via drill 1 pad 2)
  other vias: 1.79,40.72
N$283  (via drill 1 pad 2.2)
  other vias: 1.79,38.18
N$284  (via drill 1 pad 2.2)
  other vias: 4.33,38.18
N$285  (via drill 1 pad 2.2)
  other vias: 9.41,38.18
N$286  (via drill 1 pad 2.2)
  other vias: 6.87,38.18
N$287  (via drill 1 pad 2.2)
  other vias: 11.95,38.18
N$288  (via drill 1 pad 2.2)
  other vias: 14.49,38.18
N$289  (via drill 1 pad 2.2)
  other vias: 17.03,38.18
N$290  (via drill 1 pad 2.2)
  other vias: 22.11,38.18
N$291  (via drill 1 pad 2.2)
  other vias: 19.57,38.18
N$292  (via drill 1 pad 2.2)
  other vias: 24.65,38.18
N$293  (via drill 1 pad 2.2)
  other vias: 27.19,38.18
N$294  (via drill 1 pad 2.2)
  other vias: 29.73,38.18
N$295  (via drill 1 pad 2.2)
  other vias: 32.27,38.18
N$296  (via drill 1 pad 2.2)
  other vias: 34.81,38.18
N$297  (via drill 1 pad 2.2)
  other vias: 37.35,38.18
N$298  (via drill 1 pad 2.2)
  other vias: 39.89,38.18
N$299  (via drill 1 pad 2.2)
  other vias: 42.43,38.18
N$300  (via drill 1 pad 2.2)
  other vias: 42.43,35.64
N$301  (via drill 1 pad 2.2)
  other vias: 39.89,35.64
N$302  (via drill 1 pad 2.2)
  other vias: 37.35,35.64
N$303  (via drill 1 pad 2.2)
  other vias: 34.81,35.64
N$304  (via drill 1 pad 2.2)
  other vias: 32.27,35.64
N$305  (via drill 1 pad 2.2)
  other vias: 29.73,35.64
N$306  (via drill 1 pad 2.2)
  other vias: 27.19,35.64
N$307  (via drill 1 pad 2.2)
  other vias: 24.65,35.64
N$308  (via drill 1 pad 2.2)
  other vias: 22.11,35.64
N$309  (via drill 1 pad 2.2)
  other vias: 19.57,35.64
N$310  (via drill 1 pad 2.2)
  other vias: 17.03,35.64
N$311  (via drill 1 pad 2.2)
  other vias: 14.49,35.64
N$312  (via drill 1 pad 2.2)
  other vias: 11.95,35.64
N$313  (via drill 1 pad 2.2)
  other vias: 9.41,35.64
N$314  (via drill 1 pad 2.2)
  other vias: 6.87,35.64
N$315  (via drill 1 pad 2.2)
  other vias: 4.33,35.64
N$316  (via drill 1 pad 2.2)
  other vias: 1.79,35.64
N$317  (via drill 1 pad 2.2)
  other vias: 1.79,33.1
N$318  (via drill 1 pad 2.2)
  other vias: 4.33,33.1
N$319  (via drill 1 pad 2.2)
  other vias: 6.87,33.1
N$320  (via drill 1 pad 2.2)
  other vias: 9.41,33.1
N$321  (via drill 1 pad 2.2)
  other vias: 11.95,33.1
N$322  (via drill 1 pad 2.2)
  other vias: 14.49,33.1
N$323  (via drill 1 pad 2.2)
  other vias: 19.57,33.1
N$324  (via drill 1 pad 2.2)
  other vias: 17.03,33.1
N$325  (via drill 1 pad 2.2)
  other vias: 22.11,33.1
N$326  (via drill 1 pad 2.2)
  other vias: 24.65,33.1
N$327  (via drill 1 pad 2.2)
  other vias: 27.19,33.1
N$328  (via drill 1 pad 2.2)
  other vias: 29.73,33.1
N$329  (via drill 1 pad 2.2)
  other vias: 32.27,33.1
N$330  (via drill 1 pad 2.2)
  other vias: 34.81,33.1
N$331  (via drill 1 pad 2.2)
  other vias: 37.35,33.1
N$332  (via drill 1 pad 2.2)
  other vias: 39.89,33.1
N$333  (via drill 1 pad 2.2)
  other vias: 42.43,33.1
N$334  (via drill 1 pad 2.2)
  other vias: 42.43,30.56
N$335  (via drill 1 pad 2.2)
  other vias: 39.89,30.56
N$336  (via drill 1 pad 2.2)
  other vias: 37.35,30.56
N$337  (via drill 1 pad 2.2)
  other vias: 34.81,30.56
N$338  (via drill 1 pad 2.2)
  other vias: 32.27,30.56
N$339  (via drill 1 pad 2.2)
  other vias: 29.73,30.56
N$340  (via drill 1 pad 2.2)
  other vias: 27.19,30.56
N$341  (via drill 1 pad 2.2)
  other vias: 24.65,30.56
N$342  (via drill 1 pad 2.2)
  other vias: 22.11,30.56
N$343  (via drill 1 pad 2.2)
  other vias: 19.57,30.56
N$344  (via drill 1 pad 2.2)
  other vias: 17.03,30.56
N$345  (via drill 1 pad 2.2)
  other vias: 14.49,30.56
N$346  (via drill 1 pad 2.2)
  other vias: 11.95,30.56
N$347  (via drill 1 pad 2.2)
  other vias: 6.87,30.56
N$348  (via drill 1 pad 2.2)
  other vias: 9.41,30.56
N$349  (via drill 1 pad 2.2)
  other vias: 4.33,30.56
N$350  (via drill 1 pad 2.2)
  other vias: 1.79,30.56
N$351  (via drill 1 pad 2.2)
  other vias: 1.79,28.02
N$352  (via drill 1 pad 2.2)
  other vias: 1.79,25.48
N$353  (via drill 1 pad 2.2)
  other vias: 4.33,25.48
N$354  (via drill 1 pad 2.2)
  other vias: 4.33,28.02
N$355  (via drill 1 pad 2.2)
  other vias: 11.95,28.02
N$356  (via drill 1 pad 2.2)
  other vias: 11.95,25.48
N$357  (via drill 1 pad 2.2)
  other vias: 11.95,22.94
N$358  (via drill 1 pad 2.2)
  other vias: 14.49,22.94
N$359  (via drill 1 pad 2.2)
  other vias: 14.49,25.48
N$360  (via drill 1 pad 2.2)
  other vias: 14.49,28.02
N$361  (via drill 1 pad 2.2)
  other vias: 17.03,28.02
N$362  (via drill 1 pad 2.2)
  other vias: 17.03,25.48
N$363  (via drill 1 pad 2.2)
  other vias: 17.03,22.94
N$364  (via drill 1 pad 2.2)
  other vias: 19.57,22.94
N$365  (via drill 1 pad 2.2)
  other vias: 19.57,25.48
N$366  (via drill 1 pad 2.2)
  other vias: 19.57,28.02
N$367  (via drill 1 pad 2.2)
  other vias: 22.11,28.02
N$368  (via drill 1 pad 2.2)
  other vias: 22.11,25.48
N$369  (via drill 1 pad 2.2)
  other vias: 22.11,22.94
N$370  (via drill 1 pad 2.2)
  other vias: 24.65,22.94
N$371  (via drill 1 pad 2.2)
  other vias: 24.65,25.48
N$372  (via drill 1 pad 2.2)
  other vias: 24.65,28.02
N$373  (via drill 1 pad 2.2)
  other vias: 27.19,28.02
N$374  (via drill 1 pad 2.2)
  other vias: 27.19,25.48
N$375  (via drill 1 pad 2.2)
  other vias: 27.19,22.94
N$376  (via drill 1 pad 2.2)
  other vias: 29.73,22.94
N$377  (via drill 1 pad 2.2)
  other vias: 29.73,25.48
N$378  (via drill 1 pad 2.2)
  other vias: 29.73,28.02
N$379  (via drill 1 pad 2.2)
  other vias: 32.27,28.02
N$380  (via drill 1 pad 2.2)
  other vias: 32.27,25.48
N$381  (via drill 1 pad 2.2)
  other vias: 32.27,22.94
N$382  (via drill 1 pad 2.2)
  other vias: 39.89,25.48
N$383  (via drill 1 pad 2.2)
  other vias: 39.89,28.02
N$384  (via drill 1 pad 2.2)
  other vias: 42.43,28.02
N$385  (via drill 1 pad 2.2)
  other vias: 42.43,25.48
N$386  (via drill 1 pad 2.2)
  other vias: 1.79,22.94
N$387  (via drill 1 pad 2.2)
  other vias: 4.33,22.94
N$388  (via drill 1 pad 2.2)
  other vias: 6.87,22.94
N$389  (via drill 1 pad 2.2)
  other vias: 9.41,22.94
N$390  (via drill 1 pad 2.2)
  other vias: 1.79,15.32
N$391  (via drill 1 pad 2.2)
  other vias: 1.79,12.78
N$392  (via drill 1 pad 2.2)
  other vias: 1.79,10.24
N$393  (via drill 1 pad 2.2)
  other vias: 1.79,7.7
N$394  (via drill 1 pad 2.2)
  other vias: 4.33,7.7
N$395  (via drill 1 pad 2.2)
  other vias: 4.33,10.24
N$396  (via drill 1 pad 2.2)
  other vias: 4.33,12.78
N$397  (via drill 1 pad 2.2)
  other vias: 4.33,15.32
N$398  (via drill 1 pad 2.2)
  other vias: 6.87,15.32
N$399  (via drill 1 pad 2.2)
  other vias: 6.87,10.24
N$400  (via drill 1 pad 2.2)
  other vias: 6.87,12.78
N$401  (via drill 1 pad 2.2)
  other vias: 6.87,7.7
N$402  (via drill 1 pad 2.2)
  other vias: 9.41,7.7
N$403  (via drill 1 pad 2.2)
  other vias: 9.41,10.24
N$404  (via drill 1 pad 2.2)
  other vias: 9.41,12.78
N$405  (via drill 1 pad 2.2)
  other vias: 9.41,15.32
N$406  (via drill 1 pad 2.2)
  other vias: 11.95,15.32
N$407  (via drill 1 pad 2.2)
  other vias: 11.95,12.78
N$408  (via drill 1 pad 2.2)
  other vias: 11.95,10.24
N$409  (via drill 1 pad 2.2)
  other vias: 11.95,7.7
N$410  (via drill 1 pad 1.8)
  other vias: 14.49,10.24
N$411  (via drill 1 pad 1.8)
  other vias: 14.49,12.78
N$412  (via drill 1 pad 2.2)
  other vias: 14.49,15.32
N$413  (via drill 1 pad 2.2)
  other vias: 14.49,17.86
N$414  (via drill 1 pad 2.2)
  other vias: 11.95,17.86
N$415  (via drill 1 pad 2.2)
  other vias: 11.95,20.4
N$416  (via drill 1 pad 2.2)
  other vias: 14.49,20.4
N$417  (via drill 1 pad 2.2)
  other vias: 22.11,20.4
N$418  (via drill 1 pad 2.2)
  other vias: 22.11,17.86
N$419  (via drill 1 pad 2.2)
  other vias: 22.11,15.32
N$420  (via drill 1 pad 1.6)
  other vias: 22.11,12.78
N$421  (via drill 1 pad 1.6)
  other vias: 22.11,10.24
N$422  (via drill 1 pad 2.2)
  other vias: 24.65,7.7
N$423  (via drill 1 pad 2.2)
  other vias: 24.65,10.24
N$424  (via drill 1 pad 2.2)
  other vias: 27.19,7.7
N$425  (via drill 1 pad 2.2)
  other vias: 29.73,7.7
N$426  (via drill 1 pad 2.2)
  other vias: 29.73,10.24
N$427  (via drill 1 pad 2.2)
  other vias: 32.27,10.24
N$428  (via drill 1 pad 2.2)
  other vias: 37.35,10.24
N$429  (via drill 1 pad 2.2)
  other vias: 34.81,10.24
N$430  (via drill 1 pad 2.2)
  other vias: 39.89,10.24
N$431  (via drill 1 pad 2.2)
  other vias: 42.43,10.24
N$432  (via drill 1 pad 2.2)
  other vias: 44.97,10.24
N$433  (via drill 1 pad 2.2)
  other vias: 44.97,12.78
N$434  (via drill 1 pad 2.2)
  other vias: 42.43,12.78
N$435  (via drill 1 pad 2.2)
  other vias: 39.89,12.78
N$436  (via drill 1 pad 2.2)
  other vias: 37.35,12.78
N$437  (via drill 1 pad 2.2)
  other vias: 34.81,12.78
N$438  (via drill 1 pad 2.2)
  other vias: 32.27,12.78
N$439  (via drill 1 pad 2.2)
  other vias: 29.73,12.78
N$440  (via drill 1 pad 2.2)
  other vias: 27.19,10.24
N$441  (via drill 1 pad 2.2)
  other vias: 27.19,12.78
N$442  (via drill 1 pad 2.2)
  other vias: 24.65,12.78
N$443  (via drill 1 pad 2.2)
  other vias: 24.65,15.32
N$444  (via drill 1 pad 2.2)
  other vias: 27.19,15.32
N$445  (via drill 1 pad 2.2)
  other vias: 27.19,17.86
N$446  (via drill 1 pad 2.2)
  other vias: 24.65,17.86
N$447  (via drill 1 pad 2.2)
  other vias: 24.65,20.4
N$448  (via drill 1 pad 2.2)
  other vias: 27.19,20.4
N$449  (via drill 1 pad 2.2)
  other vias: 29.73,20.4
N$450  (via drill 1 pad 2.2)
  other vias: 29.73,17.86
N$451  (via drill 1 pad 2.2)
  other vias: 29.73,15.32
N$452  (via drill 1 pad 2.2)
  other vias: 32.27,15.32
N$453  (via drill 1 pad 2.2)
  other vias: 32.27,17.86
N$454  (via drill 1 pad 2.2)
  other vias: 32.27,20.4
N$455  (via drill 1 pad 2.2)
  other vias: 34.81,17.86
N$456  (via drill 1 pad 2.2)
  other vias: 34.81,15.32
N$457  (via drill 1 pad 2.2)
  other vias: 37.35,15.32
N$458  (via drill 1 pad 2.2)
  other vias: 37.35,17.86
N$459  (via drill 1 pad 2.2)
  other vias: 39.89,17.86
N$460  (via drill 1 pad 2.2)
  other vias: 39.89,15.32
N$461  (via drill 1 pad 2.2)
  other vias: 42.43,15.32
N$462  (via drill 1 pad 2.2)
  other vias: 42.43,17.86
N$463  (via drill 1 pad 2.2)
  other vias: 44.97,17.86
N$464  (via drill 1 pad 2.2)
  other vias: 44.97,15.32
N$465  (via drill 1 pad 2.2)
  other vias: 44.97,35.64
N$466  (via drill 1 pad 2.2)
  other vias: 44.97,33.1
N$468  (via drill 1 pad 2.2)
  other vias: 4.33,20.4
N$469  (via drill 1 pad 2.2)
  other vias: 6.87,20.4
N$470  (via drill 1 pad 2.2)
  other vias: 9.41,20.4
N$471  (via drill 1 pad 2.2)
  other vias: 9.41,17.86
N$472  (via drill 1 pad 2.2)
  other vias: 6.87,17.86
N$473  (via drill 1 pad 2.2)
  other vias: 4.33,17.86
N$474  (via drill 1 pad 2.2)
  other vias: 1.79,17.86
N$475  (via drill 1 pad 2.2)
  other vias: 34.81,22.94
N$476  (via drill 1 pad 2.2)
  other vias: 37.35,22.94
N$477  (via drill 1 pad 2.2)
  other vias: 39.89,22.94
N$478  (via drill 1 pad 2.2)
  other vias: 42.43,22.94
N$479  (via drill 1 pad 2.2)
  other vias: 42.43,20.4
N$480  (via drill 1 pad 2.2)
  other vias: 39.89,20.4
N$481  (via drill 1 pad 2.2)
  other vias: 37.35,20.4
N$482  (via drill 1 pad 2.2)
  other vias: 34.81,20.4
N$483  (via drill 1 pad 2.2)
  other vias: 37.35,28.02
N$484  (via drill 1 pad 2.2)
  other vias: 34.81,28.02
N$485  (via drill 1 pad 2.2)
  other vias: 34.81,25.48
N$486  (via drill 1 pad 2.2)
  other vias: 37.35,25.48
N$521  (via drill 1 pad 2.2)
  other vias: 44.97,20.4
SCL
  Top 0.3: X2.11 19.57,13.66 20.83,12.4 20.83,6.7 20.93,6.6 22.73,6.6 23.93,5.4 24.41,5.4 SCL.1
SDA
  Bottom 0.3: X2.9 19.57,10.86 20.83,9.6 20.83,6.44 SDA.1
STM-RST  (via drill 0.5, 0.6)
  Top 0.4: X1.17 53.26,21.67 54.73,20.2 54.73,16.5 55.23,16 55.23,10.5 v55.53,10.2 | STM-RST.1 78.89,6.8 70.41,6.8 70.01,7.2 65.73,7.2 v63.73,9.2
  Bottom 0.3: v55.53,10.2 56.83,8.9 57.03,8.7 58.13,8.7 59.13,9.7 63.23,9.7
  Bottom 0.4: v63.73,9.2 63.23,9.7
VUSB-DIS
  Bottom 0.25: 58.44,11.51 56.82,11.51
  Bottom 0.4: X1.13 53.24,16.59 55.33,14.5 55.33,11.9 55.73,11.5 56.71,11.5 56.82,11.51 | VUSB-DIS.1 76.35,6.8 71.31,6.9 70.25,7.96 67.03,7.86 64.02,10.88 59.08,10.88 58.44,11.51
VX  (1 unrouted)
  Top 0.48: 50.83,15.3 48.93,15.3
  Top 0.8: X1.11 52.08,14.05 50.83,15.3 | 48.93,15.3 48.63,15.6 48.63,25.3 47.63,26.3 47.63,27.9 U$33.1 | X1.19 U$58.1
  Top 1.5: U$33.1 U$58.1
  Bottom 0.8: X1.19 55.13,21.67 56.4,21.67 U$2.1

### Text on the board
tPlace: 3V | 3V | 5V | 0V | 0V | VX | RESET | 0V | 5V | R | T | VX | 3V | 0V | pt3MX | MODTRONIX.COM | 39 | 36 | 35 | 34 | 14 | 15 | 12 | 13 | F0 | F1 | A1 | A3 | A5 | A6 | A7 | VU | RS | 4 | 2 | 5 | 0V | 5V | 0V | 3V
bPlace: 3V | 3V | 5V | 0V | 0V | VX | 0V | 5V | VX | R | T | 0V | 3V | 39 | 36 | 35 | 34 | 14 | 15 | 12 | 13 | F0 | F1 | A1 | A3 | A5 | A6 | A7 | VU | RS | 2 | 4 | 5 | 0V | 5V | 0V | 3V